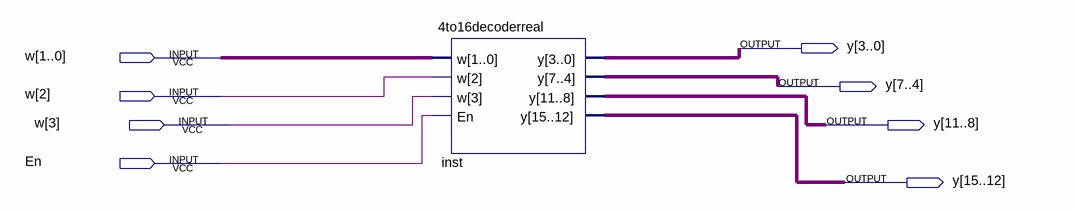
[diagram p0: schematic sheet]
// Quartus schematic Finaldecoder.bdf as structural Verilog: 1 symbols, 8 pins
module Finaldecoder (
  input  [3:0] w,
  input  En,
  output [15:0] y
);

  \4to16decoderreal  inst (.w(w), .En(En), .y(y));
endmodule
